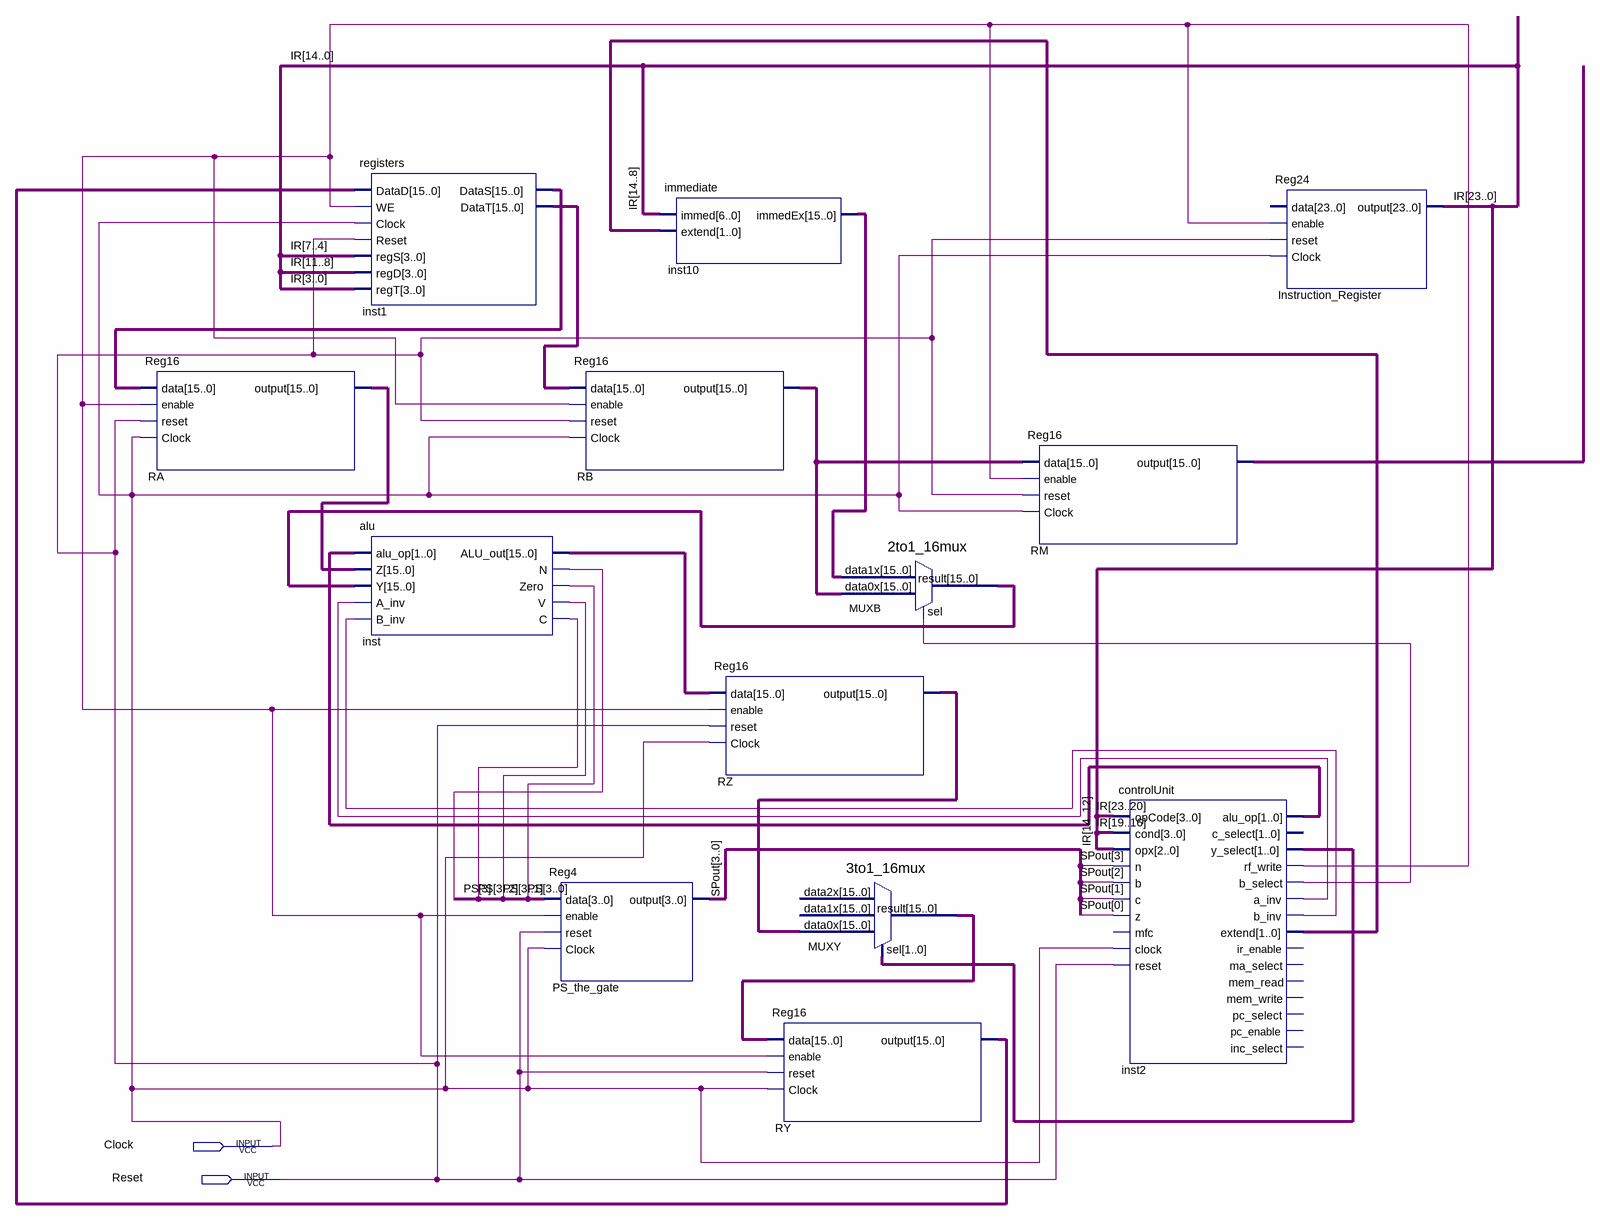
[diagram p0: schematic sheet]
// Quartus schematic ProjectMid.bdf as structural Verilog: 13 symbols, 2 pins
module ProjectMid (
  input  Clock,
  input  Reset
);

  wire inst2_a_inv, inst2_b_inv, inst2_b_select, inst2_rf_write, inst_v, inst_zero;
  wire [1:0] inst2_alu_op, inst2_extend, inst2_y_select;
  wire [3:0] PS, SPout;
  wire [15:0] inst1_datas, inst1_datat, inst10_immedex, inst_alu_out, MUXB_result, MUXY_result, RA_output,
       RB_output, RM_output, RY_output, RZ_output;
  wire [23:0] IR;

  Reg16 RA (.data(inst1_datas), .enable(inst2_rf_write), .reset(Reset), .Clock(Clock), .\output (RA_output));
  registers inst1 (
    .DataD(RY_output), .WE(inst2_rf_write), .Clock(Clock), .Reset(Reset), .regS(IR[7:4]), .regD(IR[11:8]),
    .regT(IR[3:0]), .DataS(inst1_datas), .DataT(inst1_datat));
  alu inst (
    .alu_op(inst2_alu_op), .Z(RA_output), .Y(MUXB_result), .A_inv(inst2_a_inv), .B_inv(inst2_b_inv),
    .ALU_out(inst_alu_out), .N(PS[3]), .Zero(inst_zero), .V(inst_v), .C(PS[3]));
  Reg4 PS_the_gate (.data(PS), .enable(inst2_rf_write), .reset(Reset), .Clock(Clock), .\output (SPout));
  Reg16 RB (.data(inst1_datat), .enable(inst2_rf_write), .reset(Reset), .Clock(Clock), .\output (RB_output));
  immediate inst10 (.immed(IR[14:8]), .extend(inst2_extend), .immedEx(inst10_immedex));
  Reg16 RZ (.data(inst_alu_out), .enable(inst2_rf_write), .reset(Reset), .Clock(Clock), .\output (RZ_output));
  \3to1_16mux  MUXY (.data0x(RZ_output), .sel(inst2_y_select), .result(MUXY_result));  // open: data2x, data1x
  Reg16 RY (.data(MUXY_result), .enable(inst2_rf_write), .reset(Reset), .Clock(Clock), .\output (RY_output));
  \2to1_16mux  MUXB (.data1x(inst10_immedex), .data0x(RB_output), .sel(inst2_b_select), .result(MUXB_result));
  Reg16 RM (.data(RB_output), .enable(inst2_rf_write), .reset(Reset), .Clock(Clock), .\output (RM_output));
  controlUnit inst2 (
    .opCode(IR[23:20]), .cond(IR[19:16]), .opx(IR[14:12]), .n(SPout[3]), .b(SPout[2]), .c(SPout[1]),
    .z(SPout[0]), .clock(Clock), .reset(Reset), .alu_op(inst2_alu_op), .y_select(inst2_y_select),
    .rf_write(inst2_rf_write), .b_select(inst2_b_select), .a_inv(inst2_a_inv), .b_inv(inst2_b_inv),
    .extend(inst2_extend));  // open: mfc, c_select, ir_enable, ma_select, mem_read, mem_write, pc_select, pc_enable, inc_select
  Reg24 Instruction_Register (.enable(inst2_rf_write), .reset(Reset), .Clock(Clock), .\output (IR));  // open: data
endmodule
